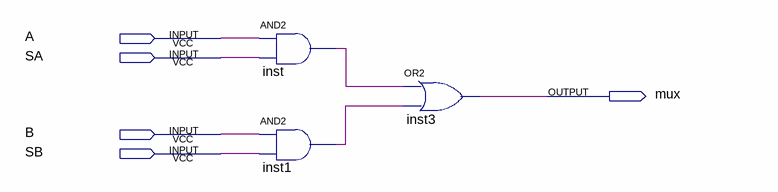
[diagram p0: schematic sheet]
// Quartus schematic mux2.bdf as structural Verilog: 3 symbols, 5 pins
module mux2 (
  input  A,
  input  SA,
  input  B,
  input  SB,
  output mux
);

  wire inst1_out, inst_out;

  and inst (inst_out, A, SA);
  and inst1 (inst1_out, B, SB);
  or inst3 (mux, inst_out, inst1_out);
endmodule
